# EAGLE design GroundStation (EAGLE 7.3.0)
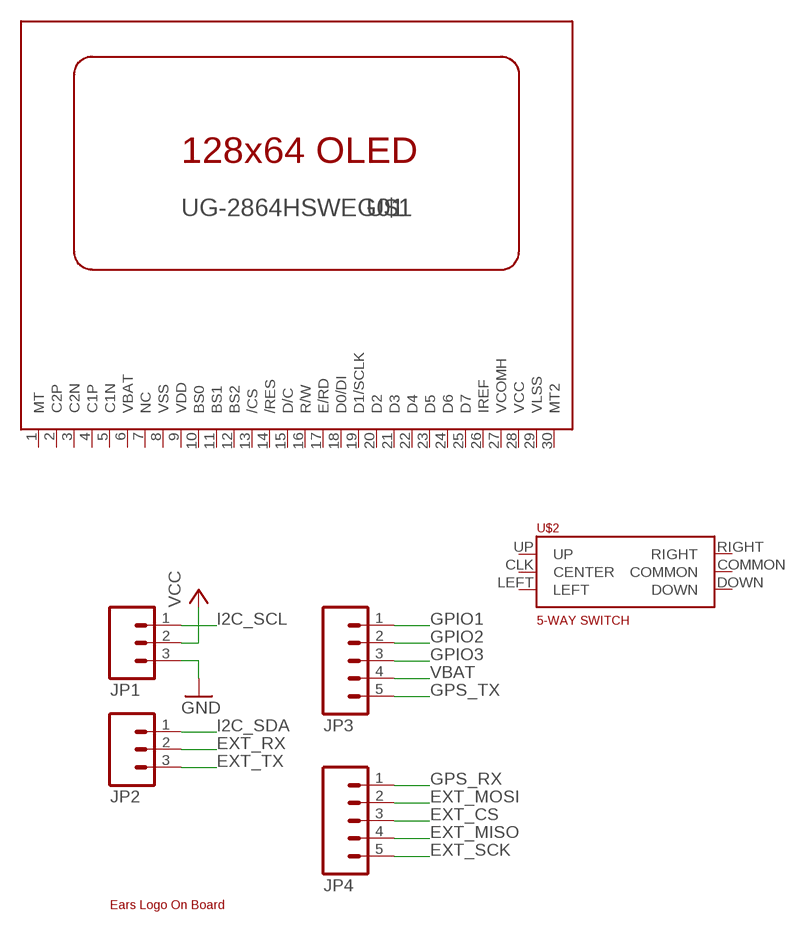
[diagram p0: schematic, sheet 1]

## Parts
JP1  M03PTH  [1X03]
JP2  M03PTH  [1X03]
JP3  M05PTH  [1X05]
JP4  M05PTH  [1X05]
U$1  UG-2864HSWEG01  [1X30-0.7MM]
U$2  5-WAY_SWITCH  [5-WAY_SWITCH]
U$10  EARS-LOGO  [EARS-LOGO]

## Nets
EXT_CS: JP4.3
EXT_MISO: JP4.4
EXT_MOSI: JP4.2
EXT_RX: JP2.2
EXT_SCK: JP4.5
EXT_TX: JP2.3
GND: JP1.3
GPIO1: JP3.1
GPIO2: JP3.2
GPIO3: JP3.3
GPS_RX: JP4.1
GPS_TX: JP3.5
I2C_SCL: JP1.1
I2C_SDA: JP2.1
VBAT: JP3.4
VCC: JP1.2
Unconnected: U$1.1(MT) U$1.2(C2P) U$1.3(C2N) U$1.4(C1P) U$1.5(C1N) U$1.6(VBAT) U$1.7(NC) U$1.10(BS0) U$1.11(BS1) U$1.12(BS2) U$1.13(/CS) U$1.14(/RES) U$1.15(D/C) U$1.16(R/W) U$1.17(E/RD) U$1.18(D0/DI) U$1.19(D1/SCLK) U$1.20(D2) U$1.21(D3) U$1.22(D4) U$1.23(D5) U$1.24(D6) U$1.25(D7) U$1.26(IREF) U$1.27(VCOMH) U$1.30(MT2) U$2.CLK(CENTER) U$2.COMMON U$2.DOWN U$2.LEFT U$2.RIGHT U$2.UP

## Power pins joined to a net without a drawn wire
VCC: U$1.28(VCC)
VDD: U$1.9(VDD)
VLSS: U$1.29(VLSS)
VSS: U$1.8(VSS)

## Library data of the parts
JP1 JP2 = SparkFun:M03: Header 3 Standard 3-pin 0.1" header. Use with straight break away headers (SKU : PRT-00116), right angle break away headers (PRT-00553), swiss pins (PRT-00743), machine pins (PRT-00117), and female headers (PRT-00115). Molex polarized connector foot print use with SKU : PRT-08232 with associated crimp pins and housings.
JP3 JP4 = SparkFun:M05: Header 5 Standard 5-pin 0.1" header. Use with straight break away headers (SKU : PRT-00116), right angle break away headers (PRT-00553), swiss pins (PRT-00743), machine pins (PRT-00117), and female headers (PRT-00115). Molex polarized connector foot print use with SKU : PRT-08230 with associated crimp pins and housings.
U$1 = adafruit:UG-2864HSWEG01: UG-2864HSWEG01 OLED display
U$2 = sneakypoo:5-WAY_SWITCH
U$10 = earsLogo:EARS-LOGO

## Board
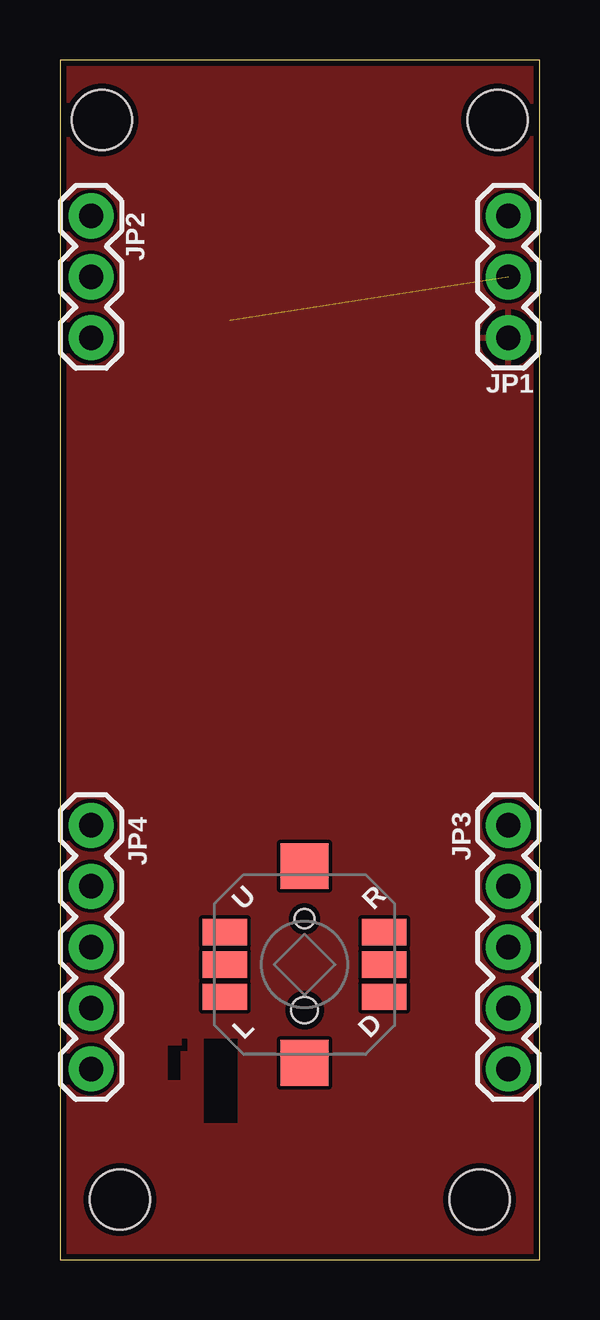
[diagram p1: board, top side]
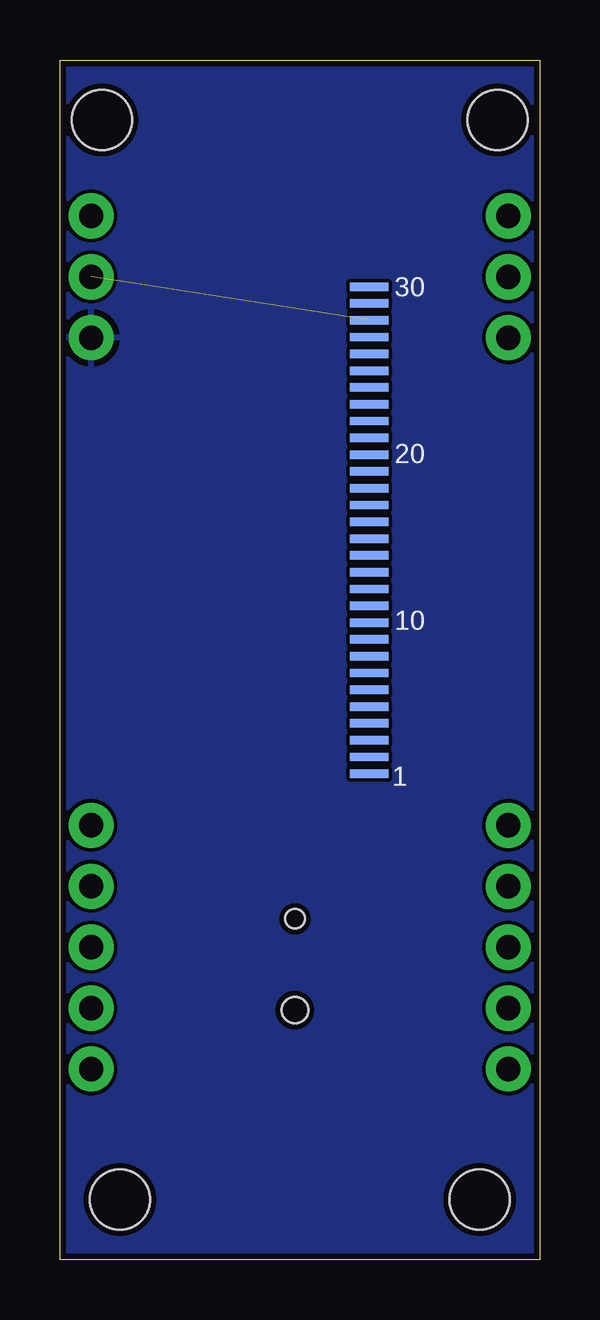
[diagram p2: board, bottom side, seen from below]

Size 20 x 50 mm. Coordinates in mm from the lower left corner, seen from the top.
Outline: 0,0 20,0 20,50 0,50 0,0
Copper layers (1*16): Top 0.035mm / dielectric 1.5mm / Bottom 0.035mm
Design rules "SeeedStudio_2layer_DRU_no_angle_20140221": minimum track width 6mil, minimum drill 12mil, track to track 6mil, track to pad 6mil, pad to pad 6mil, via to via 6mil, smd to smd 0mil, copper to edge 10mil, drill to drill 10mil, minimum pad ring 10mil, minimum via ring 6mil, stop-mask expansion 2mil, vias tented up to drill 100mil, thermal gap 10mil
Holes 2.5 mm at 1.75,47.5 18.25,47.5 2.5,2.5 17.5,2.5
tKeepout: area 0,45 to 3.5,50; area 0,0 to 5,5; area 15,0 to 20,5
bKeepout: area 0,45 to 3.5,50; area 16.5,45 to 20,50; area 0,0 to 5,5; area 15,0 to 20,5
tRestrict: area 6,5.7 to 7.4,9.2; area 4.5,7.5 to 5.3,9.2

### Footprints (pad centres in the part's own frame; a part is rotated, then mirrored left to right if it is on the bottom)
1X03 = drill 1.016 pad 1.88: 1 0,0; 2 2.54,0; 3 5.08,0
1X05 = drill 1.016 pad 1.88: 1 0,0; 2 2.54,0; 3 5.08,0; 4 7.62,0; 5 10.16,0
1X30-0.7MM = smd 0.35 x 1.6: 1 -10.15,0; 2 -9.45,0; 3 -8.75,0; 4 -8.05,0; 5 -7.35,0; 6 -6.65,0; 7 -5.95,0; 8 -5.25,0; 9 -4.55,0; 10 -3.85,0; 11 -3.15,0; 12 -2.45,0; 13 -1.75,0; 14 -1.05,0; 15 -0.35,0; 16 0.35,0; 17 1.05,0; 18 1.75,0; 19 2.45,0; 20 3.15,0; 21 3.85,0; 22 4.55,0; 23 5.25,0; 24 5.95,0; 25 6.65,0; 26 7.35,0; 27 8.05,0; 28 8.75,0; 29 9.45,0; 30 10.15,0
5-WAY_SWITCH = smd 1.85 x 1.1: CLK -3.325,0; COMMON 3.325,0; DOWN 3.325,-1.35; LEFT -3.325,-1.35; RIGHT 3.325,1.35; UP -3.325,1.35 | smd 2 x 1.9: P$7 0,4.1; P$8 0,-4.1 | hole 0.8: 0,1.9 | hole 1.1: 0,-1.9

### Placement (x,y rotation side)
JP1  18.7,43.5 270 top
JP2  1.3,43.5 270 top
JP3  18.7,18.1 270 top
JP4  1.3,18.1 270 top
U$1  7.1,30.4 90 bottom
U$2  10.2,12.3 0 top
U$10  26.1,25.9 90 bottom  (outside the outline)

### Tracks (layer width: path | path; a pad name or v marks a point on that pad's centre or on a via)
GND
  pour Bottom: 0,50 0,-0.1 20,-0.1 20,50
  pour Top: 20,-0.1 0,-0.1 0,50 20,50
VCC  (1 unrouted)